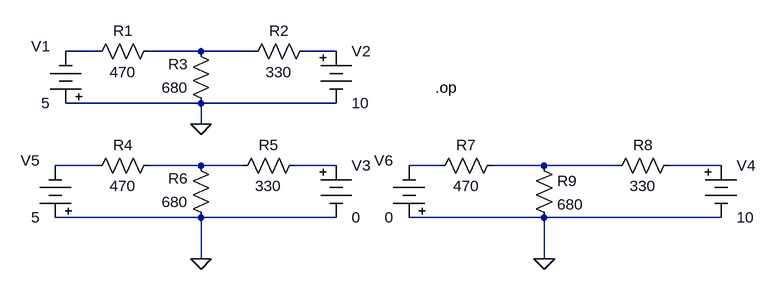
[diagram p0: schematic Superposition.asc]
Superposition.asc, the LTspice schematic file:
Version 4
SHEET 1 920 680
WIRE -96 80 -144 80
WIRE 64 80 -16 80
WIRE 144 80 64 80
WIRE 272 80 224 80
WIRE 64 160 -144 160
WIRE 272 160 64 160
WIRE 64 192 64 160
WIRE -96 256 -160 256
WIRE 64 256 -16 256
WIRE 128 256 64 256
WIRE 272 256 208 256
WIRE 432 256 384 256
WIRE 592 256 512 256
WIRE 704 256 592 256
WIRE 864 256 784 256
WIRE 64 336 -160 336
WIRE 272 336 64 336
WIRE 592 336 384 336
WIRE 864 336 592 336
WIRE 64 400 64 336
WIRE 592 400 592 336
FLAG 64 192 0
FLAG 64 400 0
FLAG 592 400 0
DATAFLAG 64 80 ""
DATAFLAG 64 256 ""
DATAFLAG 592 256 ""
SYMBOL res 0 64 R90
WINDOW 0 0 56 VBottom 2
WINDOW 3 32 56 VTop 2
SYMATTR InstName R1
SYMATTR Value 470
SYMBOL res 240 64 R90
WINDOW 0 0 56 VBottom 2
WINDOW 3 32 56 VTop 2
SYMATTR InstName R2
SYMATTR Value 330
SYMBOL res 80 176 R180
WINDOW 0 36 76 Left 2
WINDOW 3 36 40 Left 2
SYMATTR InstName R3
SYMATTR Value 680
SYMBOL Misc\\battery -144 176 R180
WINDOW 0 24 104 Left 2
WINDOW 3 24 16 Left 2
SYMATTR InstName V1
SYMATTR Value 5
SYMBOL Misc\\battery 272 64 R0
SYMATTR InstName V2
SYMATTR Value 10
SYMBOL res 0 240 R90
WINDOW 0 0 56 VBottom 2
WINDOW 3 32 56 VTop 2
SYMATTR InstName R4
SYMATTR Value 470
SYMBOL res 224 240 R90
WINDOW 0 0 56 VBottom 2
WINDOW 3 32 56 VTop 2
SYMATTR InstName R5
SYMATTR Value 330
SYMBOL res 80 352 R180
WINDOW 0 36 76 Left 2
WINDOW 3 36 40 Left 2
SYMATTR InstName R6
SYMATTR Value 680
SYMBOL res 416 272 R270
WINDOW 0 32 56 VTop 2
WINDOW 3 0 56 VBottom 2
SYMATTR InstName R7
SYMATTR Value 470
SYMBOL res 688 272 R270
WINDOW 0 32 56 VTop 2
WINDOW 3 0 56 VBottom 2
SYMATTR InstName R8
SYMATTR Value 330
SYMBOL res 576 240 R0
SYMATTR InstName R9
SYMATTR Value 680
SYMBOL Misc\\battery 272 240 R0
SYMATTR InstName V3
SYMATTR Value 0
SYMBOL Misc\\battery 864 240 R0
SYMATTR InstName V4
SYMATTR Value 10
SYMBOL Misc\\battery -160 352 R180
WINDOW 0 24 104 Left 2
WINDOW 3 24 16 Left 2
SYMATTR InstName V5
SYMATTR Value 5
SYMBOL Misc\\battery 384 352 R180
WINDOW 0 24 104 Left 2
WINDOW 3 24 16 Left 2
SYMATTR InstName V6
SYMATTR Value 0
TEXT 424 136 Left 2 !.op

The netlist it stands for:
* Superposition.asc
R1 N002 N001 470
R2 N003 N002 330
R3 0 N002 680
V1 0 N001 5
V2 N003 0 10
R4 N005 N004 470
R5 N006 N005 330
R6 0 N005 680
R7 N007 N008 470
R8 N008 N009 330
R9 N008 0 680
V3 N006 0 0
V4 N009 0 10
V5 0 N004 5
V6 0 N007 0
.op
.backanno
.end